# Altium schematic sheet DIY_BLE_Keyboard.SchDoc
size A4
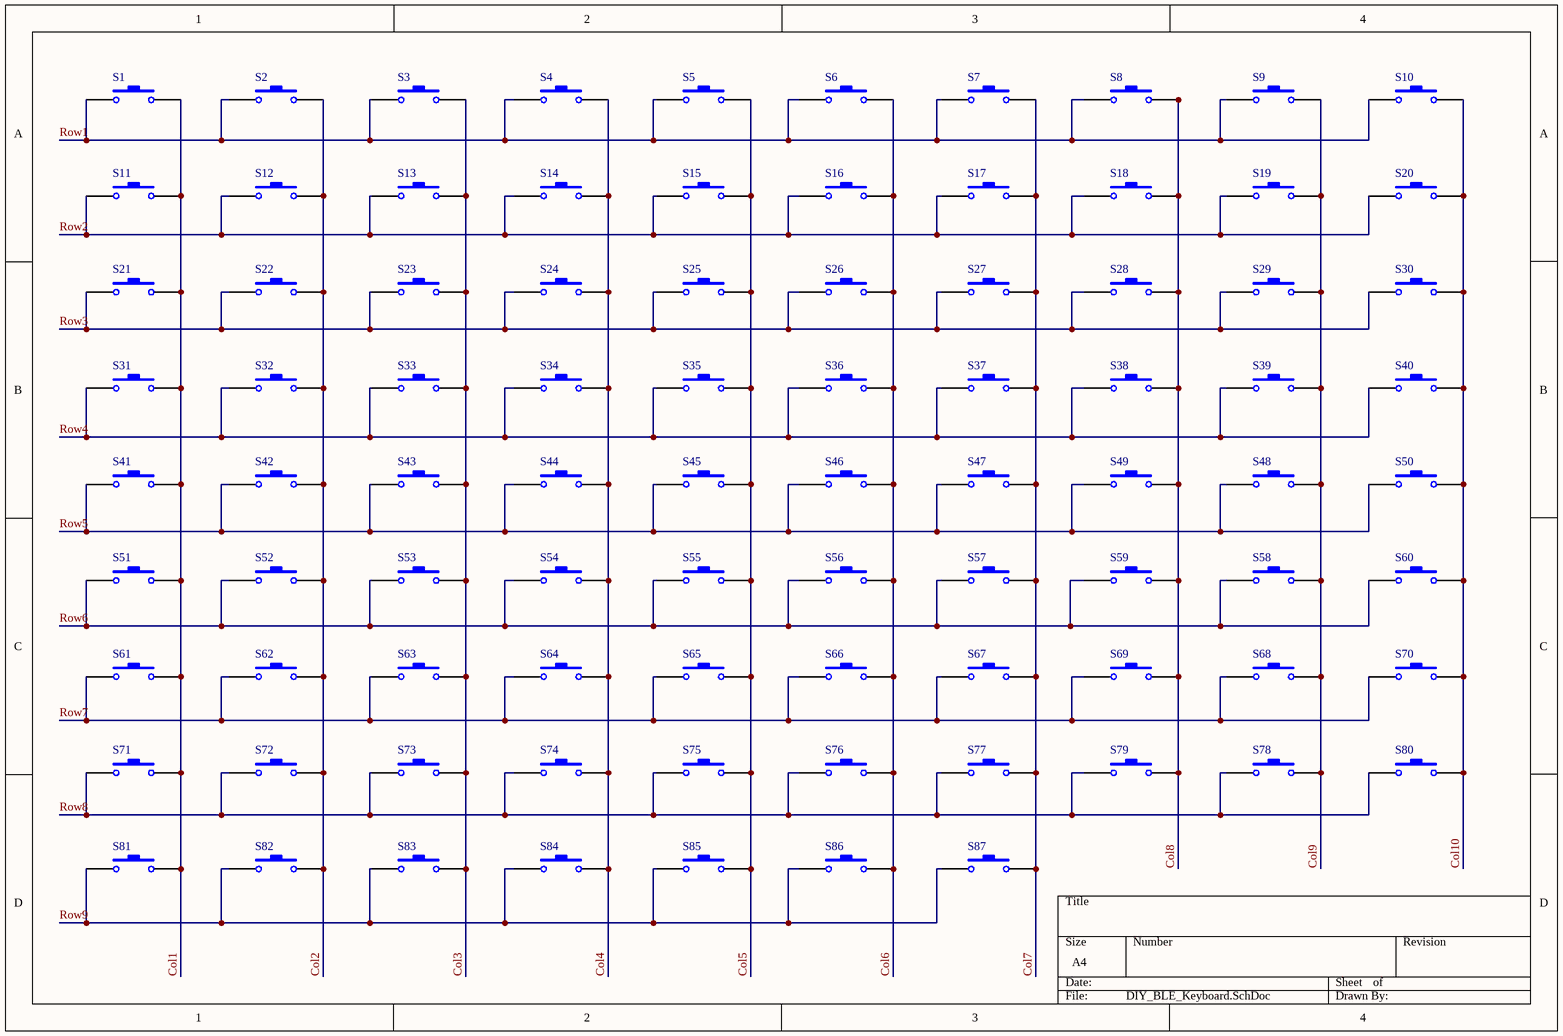
[diagram p0: DIY_BLE_Keyboard.SchDoc]

## Parts
S1  SW-PB  [MX_SW-4]  (value not drawn)
S2  SW-PB  [MX_SW-4]  (value not drawn)
S3  SW-PB  [MX_SW-4]  (value not drawn)
S4  SW-PB  [MX_SW-4]  (value not drawn)
S5  SW-PB  [MX_SW-4]  (value not drawn)
S6  SW-PB  [MX_SW-4]  (value not drawn)
S7  SW-PB  [MX_SW-4]  (value not drawn)
S8  SW-PB  [MX_SW-4]  (value not drawn)
S9  SW-PB  [MX_SW-4]  (value not drawn)
S10  SW-PB  [MX_SW-4]  (value not drawn)
S11  SW-PB  [MX_SW-4]  (value not drawn)
S12  SW-PB  [MX_SW-4]  (value not drawn)
S13  SW-PB  [MX_SW-4]  (value not drawn)
S14  SW-PB  [MX_SW-4]  (value not drawn)
S15  SW-PB  [MX_SW-4]  (value not drawn)
S16  SW-PB  [MX_SW-4]  (value not drawn)
S17  SW-PB  [MX_SW-4]  (value not drawn)
S18  SW-PB  [MX_SW-4]  (value not drawn)
S19  SW-PB  [MX_SW-4]  (value not drawn)
S20  SW-PB  [MX_SW-4]  (value not drawn)
S21  SW-PB  [MX_SW-4]  (value not drawn)
S22  SW-PB  [MX_SW-4]  (value not drawn)
S23  SW-PB  [MX_SW-4]  (value not drawn)
S24  SW-PB  [MX_SW-4]  (value not drawn)
S25  SW-PB  [MX_SW-4]  (value not drawn)
S26  SW-PB  [MX_SW-4]  (value not drawn)
S27  SW-PB  [MX_SW-4]  (value not drawn)
S28  SW-PB  [MX_SW-4]  (value not drawn)
S29  SW-PB  [MX_SW-4]  (value not drawn)
S30  SW-PB  [MX_SW-4]  (value not drawn)
S31  SW-PB  [MX_SW-4]  (value not drawn)
S32  SW-PB  [MX_SW-4]  (value not drawn)
S33  SW-PB  [MX_SW-4]  (value not drawn)
S34  SW-PB  [MX_SW-4]  (value not drawn)
S35  SW-PB  [MX_SW-4]  (value not drawn)
S36  SW-PB  [MX_SW-4]  (value not drawn)
S37  SW-PB  [MX_SW-4]  (value not drawn)
S38  SW-PB  [MX_SW-4]  (value not drawn)
S39  SW-PB  [MX_SW-4]  (value not drawn)
S40  SW-PB  [MX_SW-4]  (value not drawn)
S41  SW-PB  [MX_SW-4]  (value not drawn)
S42  SW-PB  [MX_SW-4]  (value not drawn)
S43  SW-PB  [MX_SW-4]  (value not drawn)
S44  SW-PB  [MX_SW-4]  (value not drawn)
S45  SW-PB  [MX_SW-4]  (value not drawn)
S46  SW-PB  [MX_SW-4]  (value not drawn)
S47  SW-PB  [MX_SW-4]  (value not drawn)
S48  SW-PB  [MX_SW-4]  (value not drawn)
S49  SW-PB  [MX_SW-4]  (value not drawn)
S50  SW-PB  [MX_SW-4]  (value not drawn)
S51  SW-PB  [MX_SW-4]  (value not drawn)
S52  SW-PB  [MX_SW-4]  (value not drawn)
S53  SW-PB  [MX_SW-4]  (value not drawn)
S54  SW-PB  [MX_SW-4]  (value not drawn)
S55  SW-PB  [MX_SW-4]  (value not drawn)
S56  SW-PB  [MX_SW-4]  (value not drawn)
S57  SW-PB  [MX_SW-4]  (value not drawn)
S58  SW-PB  [MX_SW-4]  (value not drawn)
S59  SW-PB  [MX_SW-4]  (value not drawn)
S60  SW-PB  [MX_SW-4]  (value not drawn)
S61  SW-PB  [MX_SW-4]  (value not drawn)
S62  SW-PB  [MX_SW-4]  (value not drawn)
S63  SW-PB  [MX_SW-4]  (value not drawn)
S64  SW-PB  [MX_SW-4]  (value not drawn)
S65  SW-PB  [MX_SW-4]  (value not drawn)
S66  SW-PB  [MX_SW-4]  (value not drawn)
S67  SW-PB  [MX_SW-4]  (value not drawn)
S68  SW-PB  [MX_SW-4]  (value not drawn)
S69  SW-PB  [MX_SW-4]  (value not drawn)
S70  SW-PB  [MX_SW-4]  (value not drawn)
S71  SW-PB  [MX_SW-4]  (value not drawn)
S72  SW-PB  [MX_SW-4]  (value not drawn)
S73  SW-PB  [MX_SW-4]  (value not drawn)
S74  SW-PB  [MX_SW-4]  (value not drawn)
S75  SW-PB  [MX_SW-4]  (value not drawn)
S76  SW-PB  [MX_SW-4]  (value not drawn)
S77  SW-PB  [MX_SW-4]  (value not drawn)
S78  SW-PB  [MX_SW-4]  (value not drawn)
S79  SW-PB  [MX_SW-4]  (value not drawn)
S80  SW-PB  [MX_SW-4]  (value not drawn)
S81  SW-PB  [MX_SW-4]  (value not drawn)
S82  SW-PB  [MX_SW-4]  (value not drawn)
S83  SW-PB  [MX_SW-4]  (value not drawn)
S84  SW-PB  [MX_SW-4]  (value not drawn)
S85  SW-PB  [MX_SW-4]  (value not drawn)
S86  SW-PB  [MX_SW-4]  (value not drawn)
S87  SW-PB  [MX_SW-4]  (value not drawn)

## Nets
Col1: S1.2 S11.2 S21.2 S31.2 S41.2 S51.2 S61.2 S71.2 S81.2
Col2: S2.2 S12.2 S22.2 S32.2 S42.2 S52.2 S62.2 S72.2 S82.2
Col3: S3.2 S13.2 S23.2 S33.2 S43.2 S53.2 S63.2 S73.2 S83.2
Col4: S4.2 S14.2 S24.2 S34.2 S44.2 S54.2 S64.2 S74.2 S84.2
Col5: S5.2 S15.2 S25.2 S35.2 S45.2 S55.2 S65.2 S75.2 S85.2
Col6: S6.2 S16.2 S26.2 S36.2 S46.2 S56.2 S66.2 S76.2 S86.2
Col7: S7.2 S17.2 S27.2 S37.2 S47.2 S57.2 S67.2 S77.2 S87.2
Col8: S8.2 S18.2 S28.2 S38.2 S49.2 S59.2 S69.2 S79.2
Col9: S9.2 S19.2 S29.2 S39.2 S48.2 S58.2 S68.2 S78.2
Col10: S10.2 S20.2 S30.2 S40.2 S50.2 S60.2 S70.2 S80.2
Row1: S1.1 S2.1 S3.1 S4.1 S5.1 S6.1 S7.1 S8.1 S9.1 S10.1
Row2: S11.1 S12.1 S13.1 S14.1 S15.1 S16.1 S17.1 S18.1 S19.1 S20.1
Row3: S21.1 S22.1 S23.1 S24.1 S25.1 S26.1 S27.1 S28.1 S29.1 S30.1
Row4: S31.1 S32.1 S33.1 S34.1 S35.1 S36.1 S37.1 S38.1 S39.1 S40.1
Row5: S41.1 S42.1 S43.1 S44.1 S45.1 S46.1 S47.1 S48.1 S49.1 S50.1
Row6: S51.1 S52.1 S53.1 S54.1 S55.1 S56.1 S57.1 S58.1 S59.1 S60.1
Row7: S61.1 S62.1 S63.1 S64.1 S65.1 S66.1 S67.1 S68.1 S69.1 S70.1
Row8: S71.1 S72.1 S73.1 S74.1 S75.1 S76.1 S77.1 S78.1 S79.1 S80.1
Row9: S81.1 S82.1 S83.1 S84.1 S85.1 S86.1 S87.1

## Library data of the parts
S1-S87 = SW-PB: Switch; Published: 24-Mar-1999; LatestRevisionDate: 17-Jul-2002; LatestRevisionNote: Re-released for DXP Platform.; PackageReference: SPST-2; Publisher: Altium Limited; PackageDescription: Switch; 2 Leads